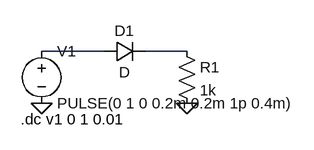
[diagram p0: schematic diodetheorie.asc]
diodetheorie.asc, the LTspice schematic file:
Version 4
SHEET 1 880 680
WIRE 64 128 -32 128
WIRE 192 128 128 128
FLAG -32 208 0
FLAG 192 208 0
SYMBOL diode 64 144 R270
WINDOW 0 32 32 VTop 2
WINDOW 3 0 32 VBottom 2
SYMATTR InstName D1
SYMBOL voltage -32 112 R0
WINDOW 123 0 0 Left 0
WINDOW 39 0 0 Left 0
SYMATTR InstName V1
SYMATTR Value PULSE(0 1 0 0.2m 0.2m 1p 0.4m)
SYMBOL res 176 112 R0
SYMATTR InstName R1
SYMATTR Value 1k
TEXT -64 232 Left 2 !.dc v1 0 1 0.01

The netlist it stands for:
* diodetheorie.asc
D1 N001 N002 D
V1 N001 0 PULSE(0 1 0 0.2m 0.2m 1p 0.4m)
R1 N002 0 1k
.model D D
.lib standard.dio
.dc v1 0 1 0.01
.backanno
.end